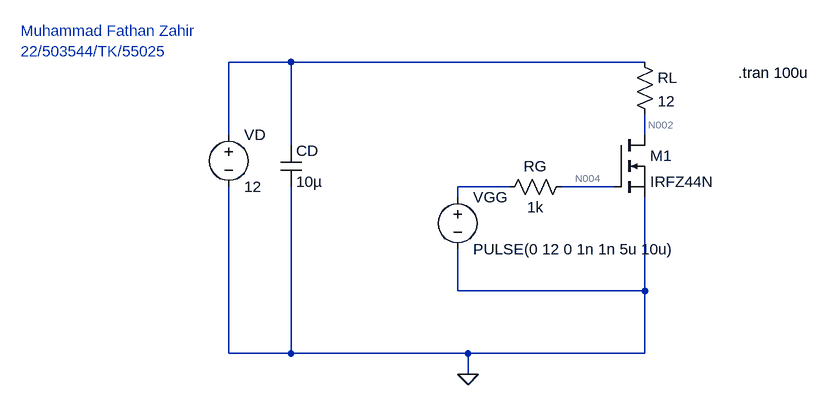
[diagram p0: schematic Circuit1.asc]
Circuit1.asc, the LTspice schematic file:
Version 4.1
SHEET 1 880 680
WIRE -48 64 -144 64
WIRE 496 64 -48 64
WIRE -144 176 -144 64
WIRE 496 176 496 144
WIRE -48 192 -48 64
WIRE 288 256 208 256
WIRE 448 256 368 256
WIRE 208 272 208 256
WIRE 208 416 208 352
WIRE 496 416 496 272
WIRE 496 416 208 416
WIRE -144 512 -144 256
WIRE -48 512 -48 256
WIRE -48 512 -144 512
WIRE 224 512 -48 512
WIRE 496 512 496 416
WIRE 496 512 224 512
WIRE 224 544 224 512
FLAG 224 544 0
SYMBOL cap -64 192 R0
SYMATTR InstName CD
SYMATTR Value 10µ
SYMBOL res 480 48 R0
SYMATTR InstName RL
SYMATTR Value 12
SYMBOL nmos 448 176 R0
SYMATTR InstName M1
SYMATTR Value IRFZ44N
SYMBOL res 384 240 R90
WINDOW 0 0 56 VBottom 2
WINDOW 3 32 56 VTop 2
SYMATTR InstName RG
SYMATTR Value 1k
SYMBOL voltage 208 256 R0
WINDOW 123 0 0 Left 0
WINDOW 39 0 0 Left 0
SYMATTR InstName VGG
SYMATTR Value PULSE(0 12 0 1n 1n 5u 10u)
SYMBOL voltage -144 160 R0
WINDOW 123 0 0 Left 0
WINDOW 39 0 0 Left 0
SYMATTR InstName VD
SYMATTR Value 12
TEXT 640 80 Left 2 !.tran 100u
TEXT -464 16 Left 2 ;Muhammad Fathan Zahir\n22/503544/TK/55025

The netlist it stands for:
* Circuit1.asc
CD N001 0 10µ
RL N001 N002 12
M1 N002 N004 0 0 IRFZ44N
RG N004 N003 1k
VGG N003 0 PULSE(0 12 0 1n 1n 5u 10u)
VD N001 0 12
.model NMOS NMOS
.model PMOS PMOS
.lib standard.mos
.tran 100u
* Muhammad Fathan Zahir
* 22/503544/TK/55025
.backanno
.end

* Results of the author's LTspice run, read from the files saved beside the schematic
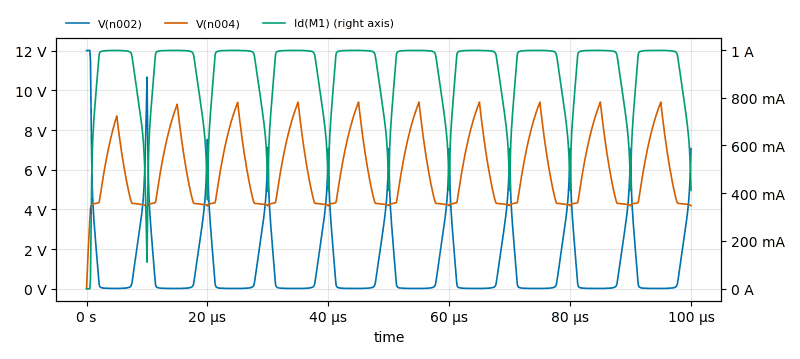
[diagram p1: Transient Analysis of Circuit1.asc, plotted from the saved traces]
* Transient Analysis, 1 run:
*   V(n002): min 14.62 mV, max 12.01 V, average 1.133 V, rms 2.266 V, last 7.06 V
*   V(n004): min 0 V, max 9.405 V, average 5.926 V, rms 6.184 V, last 4.184 V
*   Id(M1): min -1.099 mA, max 999 mA, average 905.6 mA, rms 920.2 mA, last 411.7 mA